# EAGLE design Headphone-Amplifier-ClassAB-alt5 (EAGLE 7.6.0)
4x4 - Three Transistor Headphone Amplifier - Class AB http://www.electronics-diy.com/4x4.php
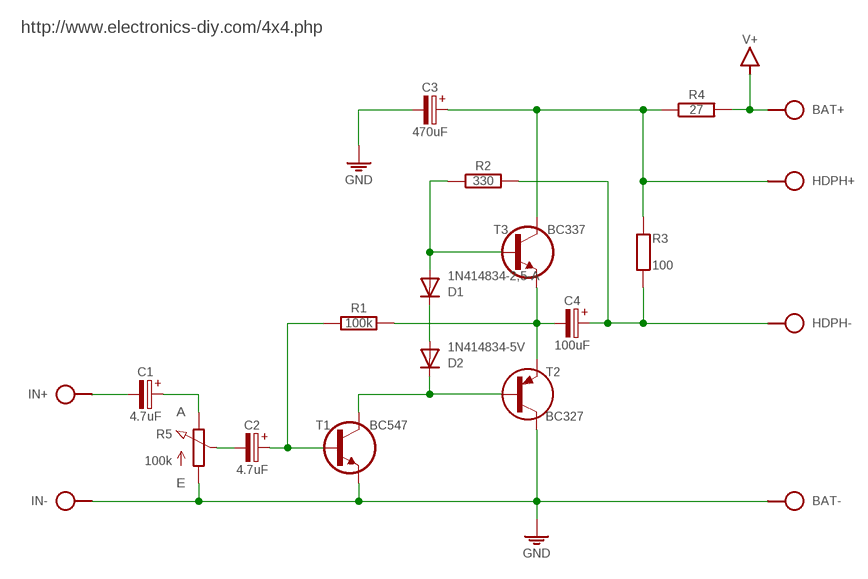
[diagram p0: schematic, sheet 1]

## Parts
BAT  SPAD+-+-  [SPAD+-]
C1  4.7uF  CPOLE2,5-4/V  [E2.5-4/V]
C2  4.7uF  CPOLE2,5-4/V  [E2.5-4/V]
C3  470uF  CPOLE2,5-5/V  [E2,5-5/V]
C4  100uF  CPOLE2,5-4/V  [E2.5-4/V]
D1  1N414834-2,5-A  [DO34-2,5-A]
D2  1N414834-5V  [DO34-5V]
HDPH  SPAD+-+-  [SPAD+-]
IN  SPAD+--+  [SPAD-+]
R1  100k  R-H0202/2  [0202/2]
R2  330  R-H0202/2V  [0202/2V]
R3  100  R0202/2  [0202/2]
R4  27  R-H0204/2.54  [0204/2.54]
R5  100k  POT-3P  [CONN-3P]
T1  BC547  BC547CBE  [TO92-CBE]
T2  BC327  [TO92]
T3  BC337  BC337CBE  [TO92-CBE]

## Nets
GND: BAT.1 C3.- IN.1 R5.1(A) T1.E T2.1(C)
N$1: D1.A R2.1 T3.B
N$2: D2.C T1.C T2.2(B)
N$3: D1.C D2.A
N$4: C4.- R1.2 T2.3(E) T3.E
N$5: C1.+ R5.3(E)
N$6: C2.- R5.2(S)
N$7: C2.+ R1.1 T1.B
N$8: C3.+ HDPH.2 R3.1 R4.1 T3.C
N$9: C4.+ HDPH.1 R2.2 R3.2
N$10: C1.- IN.2
V+: BAT.2 R4.2

## Notes on the sheet
- http://www.electronics-diy.com/4x4.php

## Library data of the parts
BAT HDPH IN = pad:SPAD+-
C1-C4 = c:CPOL: POLARIZED CAPACITOR, European symbol
D1 D2 = d:1N4148
R1 R2 R4 = r:R-H
R3 = r:R: RESISTOR, European symbol
R5 = r:POT
T1 = t:BC547
T2 = t:BC327
T3 = t:BC337

## Net classes
0 default: width 0.61 mm

## Board
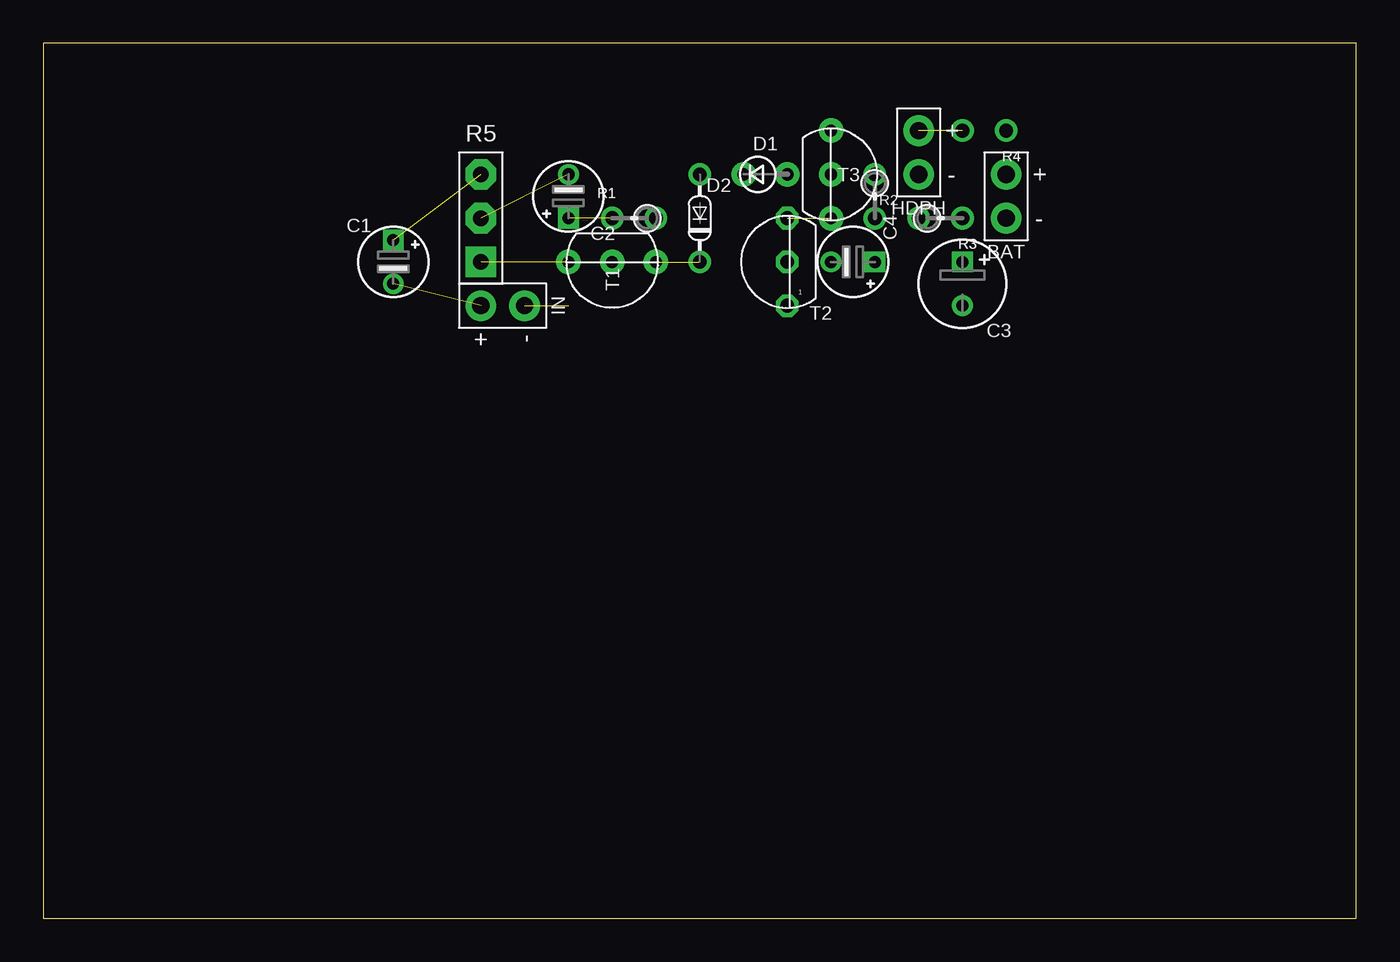
[diagram p1: board, top side]
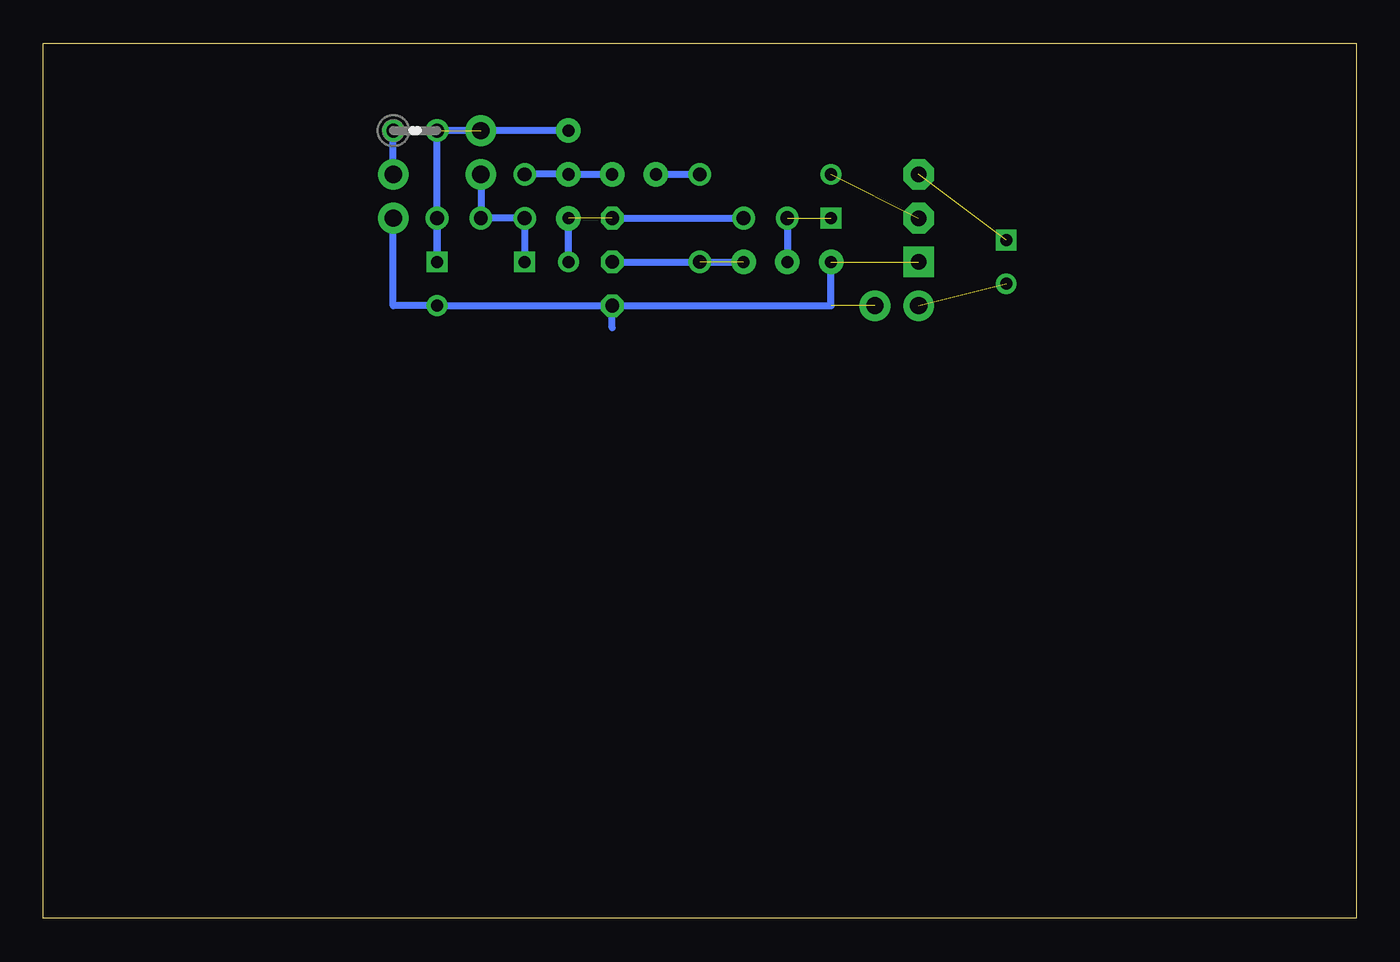
[diagram p2: board, bottom side, seen from below]

Size 76.2 x 50.8 mm. Coordinates in mm from the lower left corner, seen from the top.
Outline: 0,0 76.2,0 76.2,50.8 0,50.8 0,0
Copper layers (1*16): Top 0.035mm / dielectric 1.5mm / Bottom 0.035mm
Design rules "default": minimum track width 10mil, minimum drill 24mil, track to track 8mil, track to pad 8mil, pad to pad 8mil, via to via 8mil, smd to smd 8mil, copper to edge 40mil, drill to drill 8mil, minimum pad ring 10mil, minimum via ring 8mil, stop-mask expansion 4mil, vias tented up to drill 0mil, thermal gap 10mil

### Footprints (pad centres in the part's own frame; a part is rotated, then mirrored left to right if it is on the bottom)
SPAD+- = drill 1 pad 1.778: 1 0,-1.27; 2 0,1.27
E2.5-4/V = drill 0.7 square: + 0,1.27 | drill 0.7: - 0,-1.27
E2,5-5/V = drill 0.7 square: + 0,-1.27 | drill 0.7: - 0,1.27
DO34-2,5-A = drill 0.7 pad 1.422: A 1.27,0; C -1.27,0
DO34-5V = drill 0.8: A 0,2.54; C 0,-2.54
SPAD-+ = drill 1 pad 1.778: 1 0,-1.27; 2 0,1.27
0202/2 = drill 0.8: 1 -1.27,0; 2 1.27,0
0202/2V = drill 0.8: 1 0,-1.27; 2 0,1.27
0204/2.54 = drill 0.8: 1 1.27,0; 2 -1.27,0
CONN-3P = drill 0.9 pad 1.778 square: 1 0,-2.54 | drill 0.9 pad 1.778 octagon: 2 0,0; 3 0,2.54
TO92-CBE = drill 0.7 pad 1.422: B 0,0; C 0,2.54; E 0,-2.54
TO92 = drill 0.8 octagon: 1 0,2.54; 2 0,0; 3 0,-2.54

### Placement (x,y rotation side)
BAT  55.88,41.91 0 top
C1  20.32,38.1 0 top
C2  30.48,41.91 180 top
C3  53.34,36.83 180 top
C4  46.99,38.1 270 top
D1  41.91,43.18 0 top
D2  38.1,40.64 0 top
HDPH  50.8,44.45 0 top
IN  26.67,35.56 90 top
R1  34.29,40.64 0 top
R2  48.26,41.91 180 top
R3  52.07,40.64 180 top
R4  54.61,45.72 180 top
R5  25.4,40.64 0 top
T1  33.02,38.1 270 top
T2  43.18,38.1 180 top
T3  45.72,43.18 0 top

### Tracks (layer width: path | path; a pad name or v marks a point on that pad's centre or on a via)
GND  (2 unrouted)
  Bottom 0.406: T2.1 C3.- 55.88,35.56 BAT.1 | 43.18,34.29 T2.1 | T2.1 30.48,35.56 T1.E
N$1
  Bottom 0.406: R2.1 T3.B D1.A
N$2  (1 unrouted)
  Bottom 0.406: T2.2 T1.C
N$3
  Bottom 0.406: D1.C D2.A
N$4  (1 unrouted)
  Bottom 0.406: C4.- T3.E | T2.3 R1.2
N$5  (1 unrouted)
N$6  (1 unrouted)
N$7  (1 unrouted)
  Bottom 0.406: R1.1 T1.B
N$8  (1 unrouted)
  Bottom 0.406: T3.C R4.1 C3.+ R3.1
N$9
  Bottom 0.406: C4.+ R2.2 R3.2 HDPH.1
N$10  (1 unrouted)
V+
  Bottom 0.406: BAT.2 R4.2